# Altium schematic sheet Main_4.SchDoc
size 219 x 170 mm; SheetNumber: 7; SheetTotal: 12
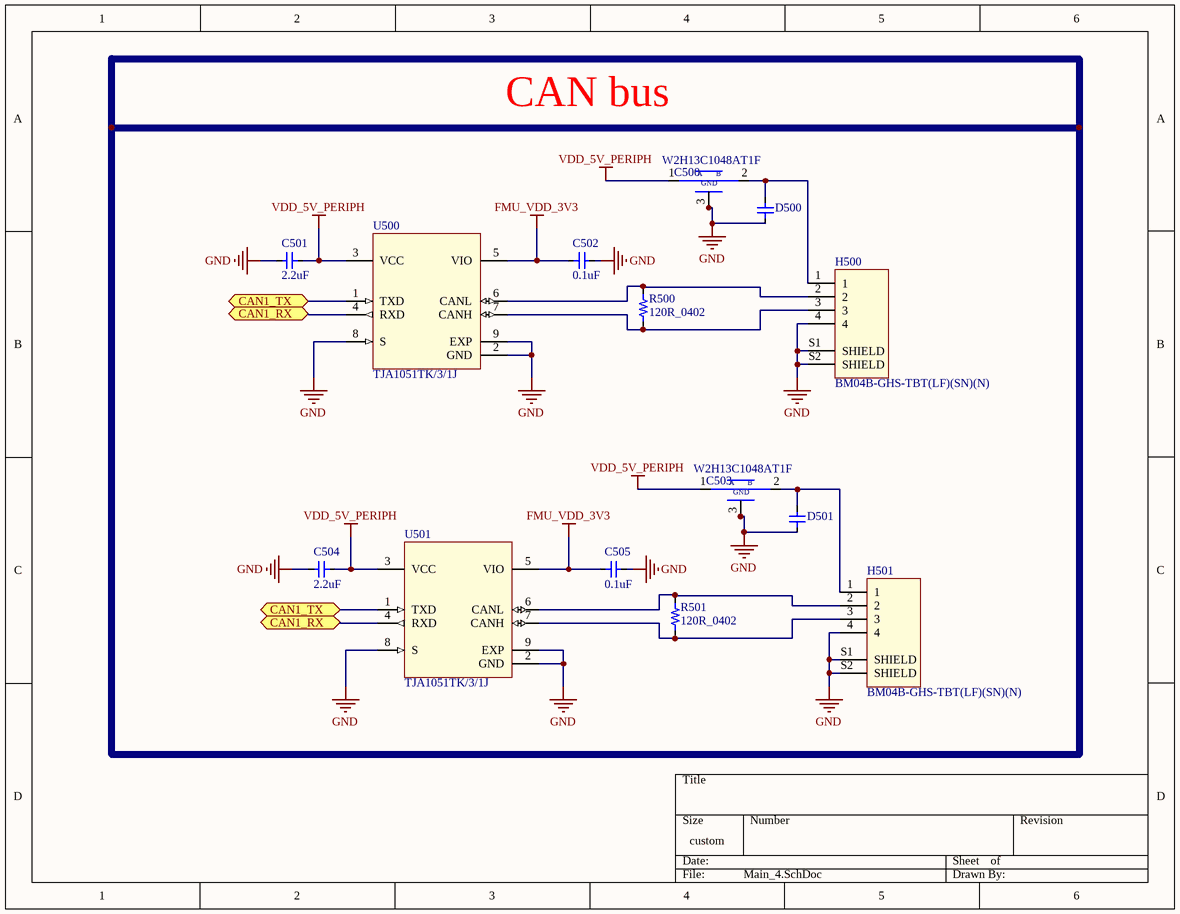
[diagram p0: Main_4.SchDoc]

## Parts
C500  W2H13C1048AT1F  [W2H13C1048AT1F]
C501  2.2uF  [C0603]
C502  0.1uF  [C0603]
C503  W2H13C1048AT1F  [W2H13C1048AT1F]
C504  2.2uF  [C0603]
C505  0.1uF  [C0603]
D500  PESD0402-140  [PESD0402-140]  (value not drawn)
D501  PESD0402-140  [PESD0402-140]  (value not drawn)
H500  BM04B-GHS-TBT(LF)(SN)(N)  [BM04B-GHS-TBT(LF)(SN)(N)]
H501  BM04B-GHS-TBT(LF)(SN)(N)  [BM04B-GHS-TBT(LF)(SN)(N)]
R500  120R_0402  [R0402]
R501  120R_0402  [R0402]
U500  TJA1051TK/3/1J  [8HVSON]
U501  TJA1051TK/3/1J  [8HVSON]

## Ports
CAN1_RX (bidir), CAN1_TX (bidir)

## Nets
FMU_VDD_3V3: C502.1 C505.1 U500.5(VIO) U501.5(VIO)
GND: C500.3 C500.4 C501.2 C502.2 C503.3 C503.4 C504.2 C505.2 D500.1 D501.1 H500.4 H500.S1(SHIELD) H500.S2(SHIELD) H501.4 H501.S1(SHIELD) H501.S2(SHIELD) U500.2(GND) U500.8(S) U500.9(EXP) U501.2(GND) U501.8(S) U501.9(EXP)
VDD_5V_PERIPH: C500.1 C501.1 C503.1 C504.1 U500.3(VCC) U501.3(VCC)
CAN1_RX: U500.4(RXD) U501.4(RXD) ; port CAN1_RX
CAN1_TX: U500.1(TXD) U501.1(TXD) ; port CAN1_TX
NetC500_2: C500.2 D500.2 H500.1
NetC503_2: C503.2 D501.2 H501.1
NetH500_2: H500.2 R500.2 U500.6(CANL)
NetH500_3: H500.3 R500.1 U500.7(CANH)
NetH501_2: H501.2 R501.2 U501.6(CANL)
NetH501_3: H501.3 R501.1 U501.7(CANH)

## Notes on the sheet
- CAN bus
- (in symbol W2H13C1048AT1F) A; B; GND

## Library data of the parts
C500 C503 = W2H13C1048AT1F: Feed Through Capacitors 25V 0.1uF X7R
C501 C504 = CC0603KPX5R6BB225: 2.2 µF ±10% 10V Ceramic Capacitor X5R 0603 (1608 Metric)
C502 C505 = CC0603KRX7R8BB104: CAP CER 0.1UF 25V X7R 0603
D500 D501 = PESD0402-140: 40V Clamp - Ipp Tvs Diode Surface Mount 0402
H500 H501 = BM04B-GHS-TBT(LF)(SN)(N): Connector Header Surface Mount 4 position 0.049" (1.25mm)
R500 R501 = RC0402FR-07120RL: 120 Ohms ±1% 0.063W, 1/16W Chip Resistor 0402 (1005 Metric) Moisture Resistant Thick Film
U500 U501 = TJA1051TK/3/1J: IC TRANSCEIVER HALF 1/1 8HVSON